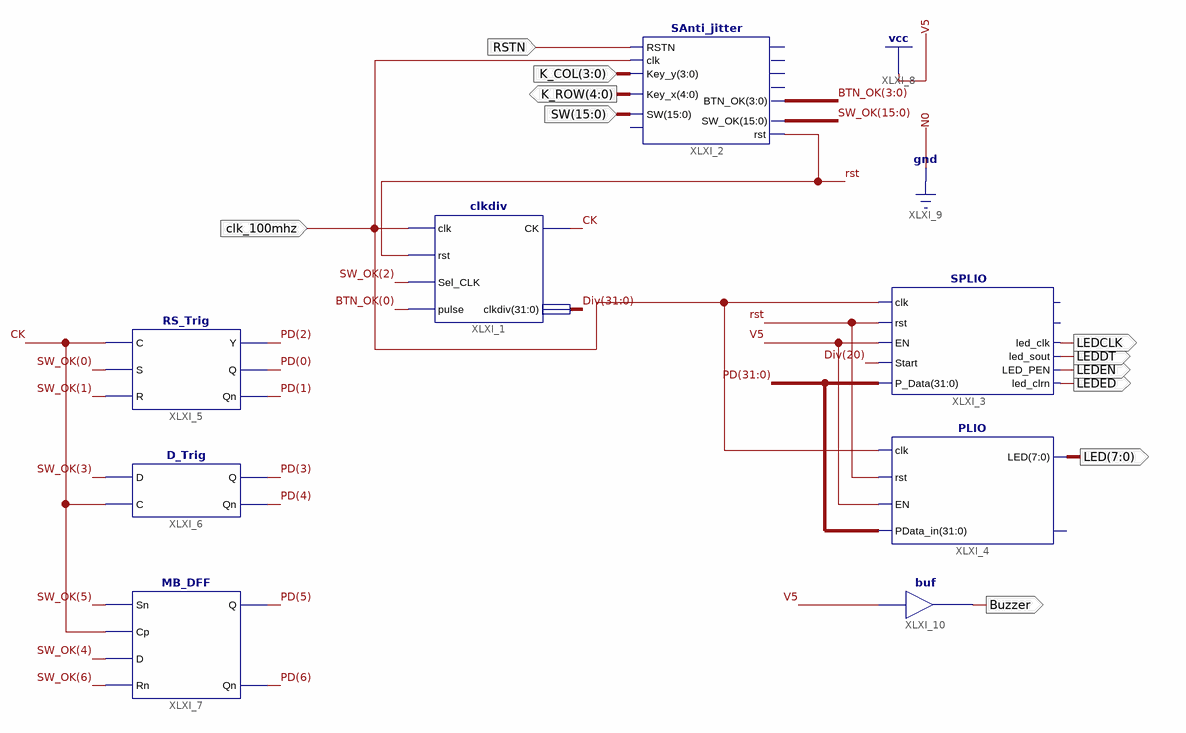
[diagram p0: schematic sheet 1]
// Xilinx ISE schematic Top_Trigger.sch (kintex7) as structural Verilog: 8 symbols, 11 ports
module Top_Trigger (
  input  RSTN,
  input  clk_100mhz,
  input  [15:0] SW,
  input  [3:0] K_COL,
  output [7:0] LED,
  output LEDED,
  output LEDEN,
  output LEDDT,
  output LEDCLK,
  output [4:0] K_ROW,
  output Buzzer
);

  wire CK, rst;
  wire [3:0] BTN_OK;
  wire [15:0] SW_OK;
  wire [31:0] Div, PD;

  clkdiv XLXI_1 (.clk(clk_100mhz), .rst(rst), .Sel_CLK(SW_OK[2]), .pulse(BTN_OK[0]), .CK(CK), .clkdiv(Div));
  SAnti_jitter XLXI_2 (
    .SW(SW), .Key_y(K_COL), .Key_x(K_ROW), .RSTN(RSTN), .clk(clk_100mhz), .rst(rst), .SW_OK(SW_OK),
    .BTN_OK(BTN_OK));  // open: readn, Key_out, Key_ready, CR, pulse_out
  SPLIO XLXI_3 (
    .clk(clk_100mhz), .P_Data(PD), .rst(rst), .EN(1'b1), .Start(Div[20]), .led_clk(LEDCLK), .led_clrn(LEDED),
    .LED_PEN(LEDEN), .led_sout(LEDDT));  // open: LED, GPIOf0
  PLIO XLXI_4 (.clk(clk_100mhz), .rst(rst), .EN(1'b1), .PData_in(PD), .LED(LED));  // open: GPIOf0
  RS_Trig XLXI_5 (.C(CK), .S(SW_OK[0]), .R(SW_OK[1]), .Y(PD[2]), .Q(PD[0]), .Qn(PD[1]));
  D_Trig XLXI_6 (.D(SW_OK[3]), .C(CK), .Q(PD[3]), .Qn(PD[4]));
  MB_DFF XLXI_7 (.Sn(SW_OK[5]), .Cp(CK), .D(SW_OK[4]), .Rn(SW_OK[6]), .Q(PD[5]), .Qn(PD[6]));
  buf XLXI_10 (Buzzer, 1'b1);
endmodule
